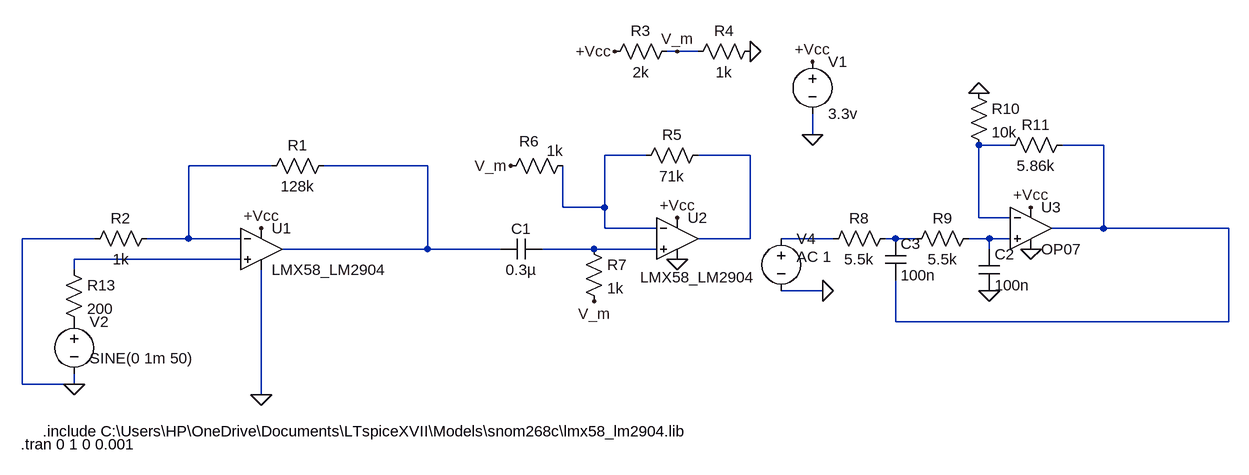
[diagram p0: schematic Preamp_v5.asc]
Preamp_v5.asc, the LTspice schematic file:
Version 4
SHEET 1 1772 680
WIRE 656 -112 640 -112
WIRE 688 -112 656 -112
WIRE 864 16 864 -16
WIRE 1168 32 1120 32
WIRE 1312 32 1248 32
WIRE 608 48 544 48
WIRE 768 48 688 48
WIRE 32 64 -96 64
WIRE 272 64 112 64
WIRE 480 128 480 64
WIRE 544 128 544 48
WIRE 544 128 480 128
WIRE 1120 144 1120 32
WIRE 1168 144 1120 144
WIRE 544 160 544 128
WIRE 624 160 544 160
WIRE 1312 160 1312 32
WIRE 1312 160 1232 160
WIRE 1504 160 1312 160
WIRE -240 176 -352 176
WIRE -96 176 -96 64
WIRE -96 176 -160 176
WIRE -16 176 -96 176
WIRE 768 176 768 48
WIRE 768 176 688 176
WIRE 896 176 816 176
WIRE 992 176 976 176
WIRE 1024 176 992 176
WIRE 1136 176 1104 176
WIRE 1168 176 1136 176
WIRE 272 192 272 64
WIRE 272 192 48 192
WIRE 384 192 272 192
WIRE 528 192 448 192
WIRE 624 192 528 192
WIRE 1136 192 1136 176
WIRE -16 208 -272 208
WIRE -272 224 -272 208
WIRE 880 256 816 256
WIRE 992 304 992 240
WIRE 1504 304 1504 160
WIRE 1504 304 992 304
WIRE -352 400 -352 176
WIRE -272 400 -272 384
WIRE -272 400 -352 400
WIRE 16 416 16 224
FLAG 864 -96 +Vcc
FLAG 864 16 0
FLAG 16 160 +Vcc
FLAG 560 -112 +Vcc
FLAG 768 -112 0
FLAG 16 416 0
FLAG 656 144 +Vcc
FLAG 656 208 0
FLAG 656 -112 V_m
FLAG 400 64 V_m
FLAG 528 272 V_m
FLAG 1136 256 0
FLAG 1200 128 +Vcc
FLAG 1200 192 0
FLAG -272 400 0
FLAG 880 256 0
FLAG 1120 -48 0
SYMBOL voltage 864 -112 R0
WINDOW 123 0 0 Left 0
WINDOW 39 0 0 Left 0
SYMATTR InstName V1
SYMATTR Value 3.3v
SYMBOL voltage -272 288 R0
WINDOW 123 24 44 Left 2
WINDOW 39 0 0 Left 0
WINDOW 3 24 72 Left 2
SYMATTR Value SINE(0 1m 50)
SYMATTR InstName V2
SYMBOL res 128 48 R90
WINDOW 0 0 56 VBottom 2
WINDOW 3 32 56 VTop 2
SYMATTR InstName R1
SYMATTR Value 128k
SYMBOL res -144 160 R90
WINDOW 0 0 56 VBottom 2
WINDOW 3 32 56 VTop 2
SYMATTR InstName R2
SYMATTR Value 1k
SYMBOL res 656 -128 R90
WINDOW 0 0 56 VBottom 2
WINDOW 3 32 56 VTop 2
SYMATTR InstName R3
SYMATTR Value 2k
SYMBOL res 784 -128 R90
WINDOW 0 0 56 VBottom 2
WINDOW 3 32 56 VTop 2
SYMATTR InstName R4
SYMATTR Value 1k
SYMBOL OpAmps\\opamp2 656 112 R0
WINDOW 3 -57 123 Left 2
SYMATTR Value LMX58_LM2904
SYMATTR InstName U2
SYMBOL res 704 32 R90
WINDOW 0 0 56 VBottom 2
WINDOW 3 32 56 VTop 2
SYMATTR InstName R5
SYMATTR Value 71k
SYMBOL res 496 48 R90
WINDOW 0 -6 68 VBottom 2
WINDOW 3 -23 28 VTop 2
SYMATTR InstName R6
SYMATTR Value 1k
SYMBOL res 512 176 R0
SYMATTR InstName R7
SYMATTR Value 1k
SYMBOL res 992 160 R90
WINDOW 0 0 56 VBottom 2
WINDOW 3 32 56 VTop 2
SYMATTR InstName R8
SYMATTR Value 5.5k
SYMBOL res 1120 160 R90
WINDOW 0 0 56 VBottom 2
WINDOW 3 32 56 VTop 2
SYMATTR InstName R9
SYMATTR Value 5.5k
SYMBOL res 1264 16 R90
WINDOW 0 0 56 VBottom 2
WINDOW 3 32 56 VTop 2
SYMATTR InstName R11
SYMATTR Value 5.86k
SYMBOL cap 1120 192 R0
SYMATTR InstName C2
SYMATTR Value 100n
SYMBOL cap 976 176 R0
SYMATTR InstName C3
SYMATTR Value 100n
SYMBOL res -288 208 R0
SYMATTR InstName R13
SYMATTR Value 200
SYMBOL OpAmps\\opamp2 16 128 R0
SYMATTR InstName U1
SYMATTR Value LMX58_LM2904
SYMBOL cap 448 176 R90
WINDOW 0 0 32 VBottom 2
WINDOW 3 32 32 VTop 2
SYMATTR InstName C1
SYMATTR Value 0.3µ
SYMBOL voltage 816 160 R0
WINDOW 123 24 44 Left 2
WINDOW 39 0 0 Left 0
WINDOW 3 24 72 Left 2
SYMATTR Value2 AC 1
SYMATTR Value ""
SYMATTR InstName V4
SYMBOL res 1104 -64 R0
SYMATTR InstName R10
SYMATTR Value 10k
SYMBOL OpAmps\\OP07 1200 96 R0
SYMATTR InstName U3
TEXT -320 472 Left 2 !.include C:\\Users\\HP\\OneDrive\\Documents\\LTspiceXVII\\Models\\snom268c\\lmx58_lm2904.lib
TEXT -354 492 Left 2 !.tran 0 1 0 0.001

The netlist it stands for:
* Preamp_v5.asc
V1 +Vcc 0 3.3v
V2 P001 0 SINE(0 1m 50)
R1 N006 N005 128k
R2 N005 0 1k
R3 V_m +Vcc 2k
R4 0 V_m 1k
XU2 N010 N003 +Vcc 0 N004 LMX58_LM2904  ; pins In+ In- V+ V- OUT
R5 N004 N003 71k
R6 N003 V_m 1k
R7 N010 V_m 1k
R8 N008 N007 5.5k
R9 N009 N008 5.5k
R11 N002 N001 5.86k
C2 N009 0 100n
C3 N008 N002 100n
R13 N011 P001 200
XU1 N011 N005 +Vcc 0 N006 LMX58_LM2904  ; pins In+ In- V+ V- OUT
C1 N010 N006 0.3µ
V4 N007 0 AC 1
R10 0 N001 10k
XU3 N009 N001 +Vcc 0 N002 LT1001  ; OP07, pins In+ In- V+ V- OUT
.include C:\Users\HP\OneDrive\Documents\LTspiceXVII\Models\snom268c\lmx58_lm2904.lib
.tran 0 1 0 0.001
.lib LTC.lib
.backanno
.end